# EAGLE design schematic_without_jumperlable (EAGLE 9.6.2)
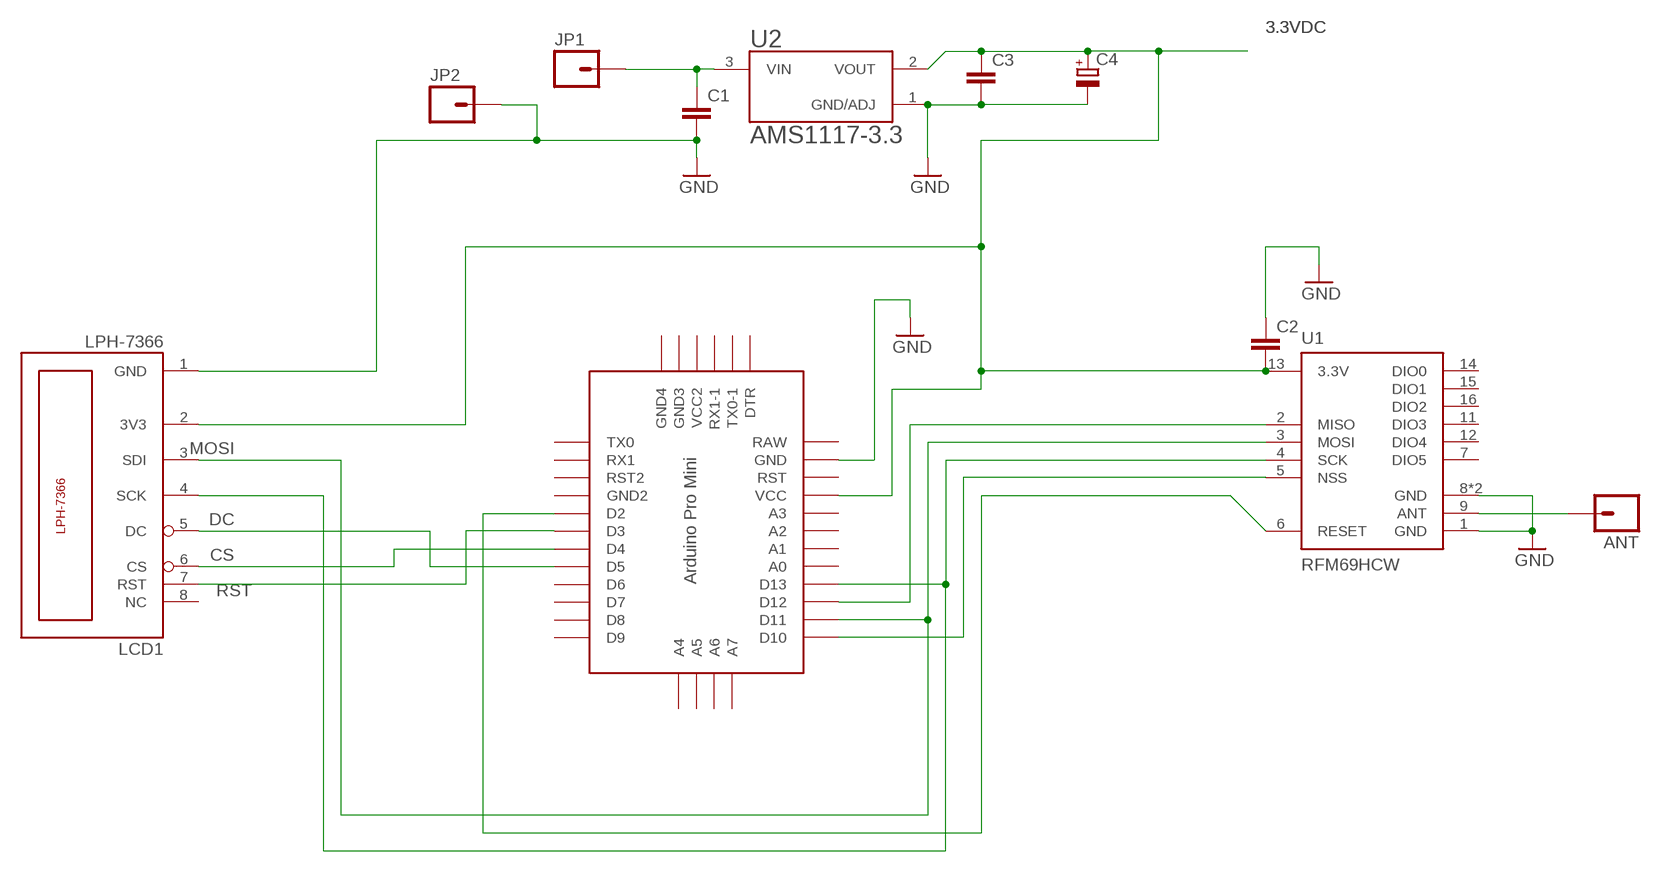
[diagram p0: schematic, sheet 1]

## Parts
ANT  M01SMDNS  [1X01NS]
C1  C-EU025-030X050  [C025-030X050]
C2  C-EU025-030X050  [C025-030X050]
C3  C-EU025-030X050  [C025-030X050]
C4  CPOL-EUE5-8.5  [E5-8,5]
JP1  M01SMDNS  [1X01NS]
JP2  M01SMDNS  [1X01NS]
LCD1  LPH-7366  [LPH-7366]
U1  RFM69HCW  [RFM69HCW-XXXS2]
U2  AMS1117-3.3  [SOT229P700X180-4N]
U$1  PRO-MINI  [PRO-MINI]

## Nets
3.3VDC: C2.2 C3.1 C4.+ LCD1.2(3V3) U1.13(3.3V) U2.2(VOUT) U$1.VCC
ANT: ANT.1 U1.9(ANT)
CS: LCD1.6(CS) U$1.D4
DC: LCD1.5(DC) U$1.D5
GND: C1.2 C2.1 C3.2 C4.- JP2.1 LCD1.1(GND) U1.1(GND) U1.8(GND) U1.10(GND) U2.1(GND/ADJ) U$1.GND
MISO: U1.2(MISO) U$1.D12
MOSI: LCD1.3(SDI) U1.3(MOSI) U$1.D11
NSS: U1.5(NSS) U$1.D10
RESET: U1.6(RESET) U$1.D2
RST: LCD1.7(RST) U$1.D3
SCK: LCD1.4(SCK) U1.4(SCK) U$1.D13
VIN: C1.1 JP1.1 U2.3(VIN)
Unconnected: LCD1.8(NC) U1.7(DIO5) U1.11(DIO3) U1.12(DIO4) U1.14(DIO0) U1.15(DIO1) U1.16(DIO2) U$1.A0 U$1.A1 U$1.A2 U$1.A3 U$1.A4 U$1.A5 U$1.A6 U$1.A7 U$1.D6 U$1.D7 U$1.D8 U$1.D9 U$1.DTR U$1.GND1(GND2) U$1.GND2(GND4) U$1.GND3 U$1.RST U$1.RST1(RST2) U$1.RX1 U$1.RX1-1 U$1.TX0 U$1.TX0-1 U$1.VCC1(VCC2)

## Power pins joined to a net without a drawn wire
RAW: U$1.RAW

## Library data of the parts
ANT JP1 JP2 = mike-temp:M01: Header 1 Standard 1-pin 0.1" header. Use with straight break away headers (SKU : PRT-00116), right angle break away headers (PRT-00553), swiss pins (PRT-00743), machine pins (PRT-00117), and female headers (PRT-00115).
C1-C3 = rcl:C-EU: CAPACITOR, European symbol; SPICEPREFIX: C
C4 = rcl:CPOL-EU: POLARIZED CAPACITOR, European symbol; SPICEPREFIX: C
LCD1 = lph-7366:LPH-7366
U1 = mike-temp:RFM69H
U2 = AMS1117-3.3:AMS1117-3.3: Check availability <https://pricing.snapeda.com/parts/AMS1117-3.3/Advanced%20Monolithic%20Systems/view-part?ref=eda>; AVAILABILITY: In Stock; DESCRIPTION: Sot223/Pkg 1-Amp 3.3-Volt Low Drop Out Voltage Regulatator; MF: Advanced Monolithic Systems; MP: AMS1117-3.3; PACKAGE: SOT-223 Seeed Technology; PRICE: None; PURCHASE-URL: https://pricing.snapeda.com/search/part/AMS1117-3.3/?ref=eda
U$1 = Arduino-clone:PRO-MINI: Arduion Pro Mini Clone V1.0 www.betemcu.cu

## Board
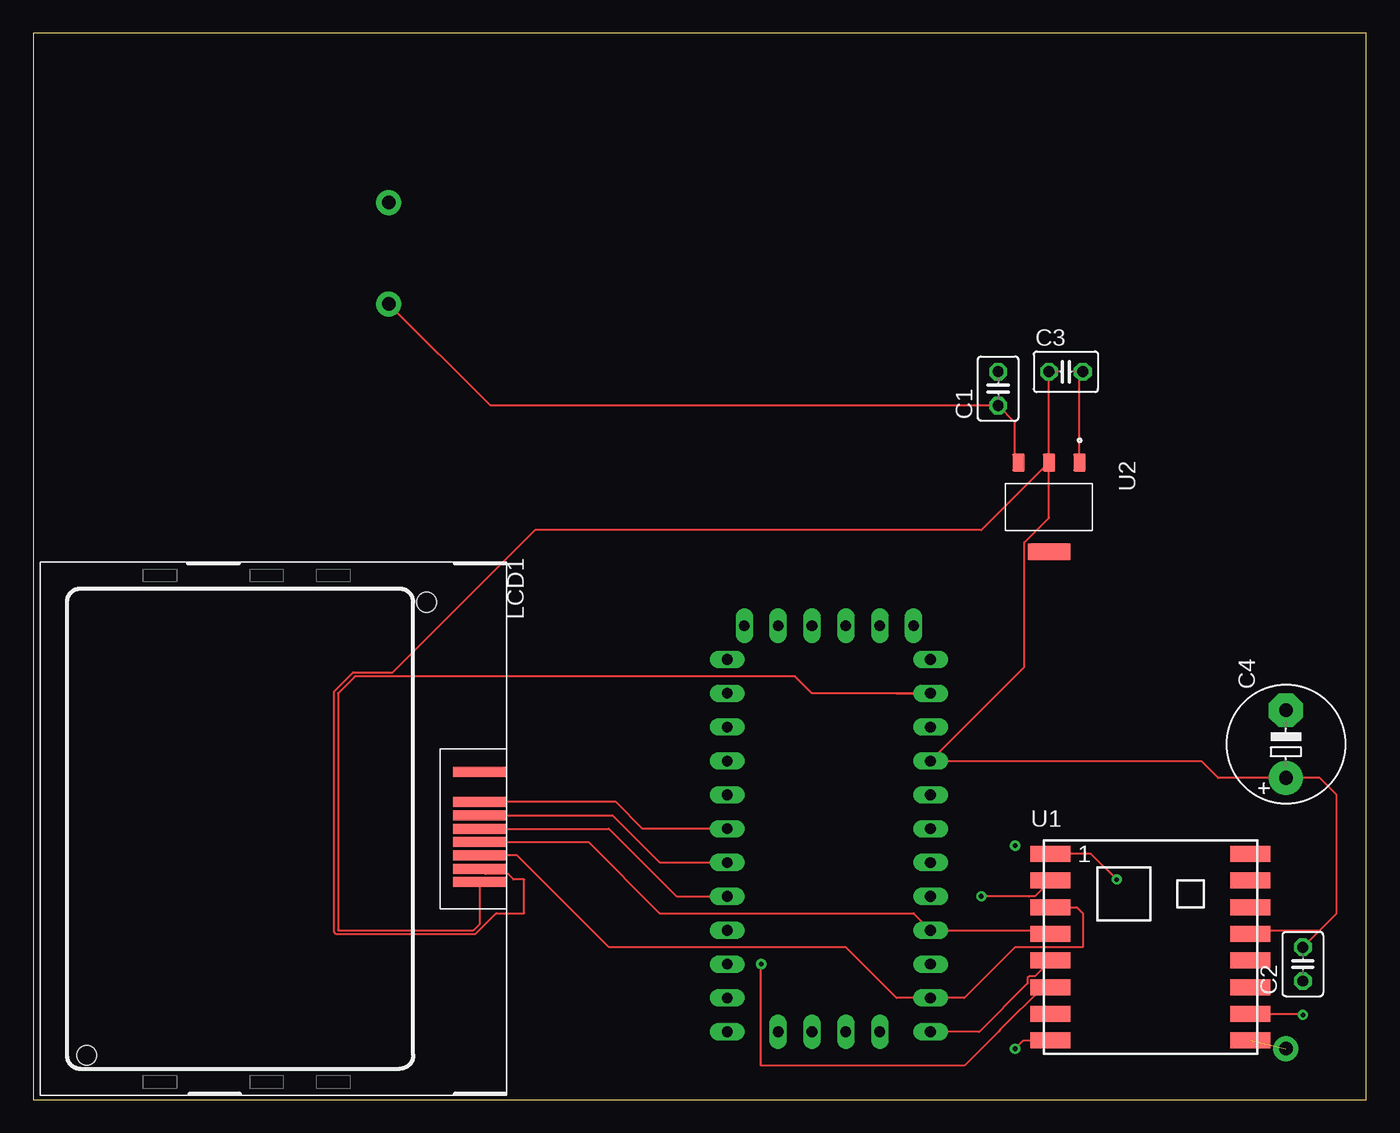
[diagram p1: board, top side]
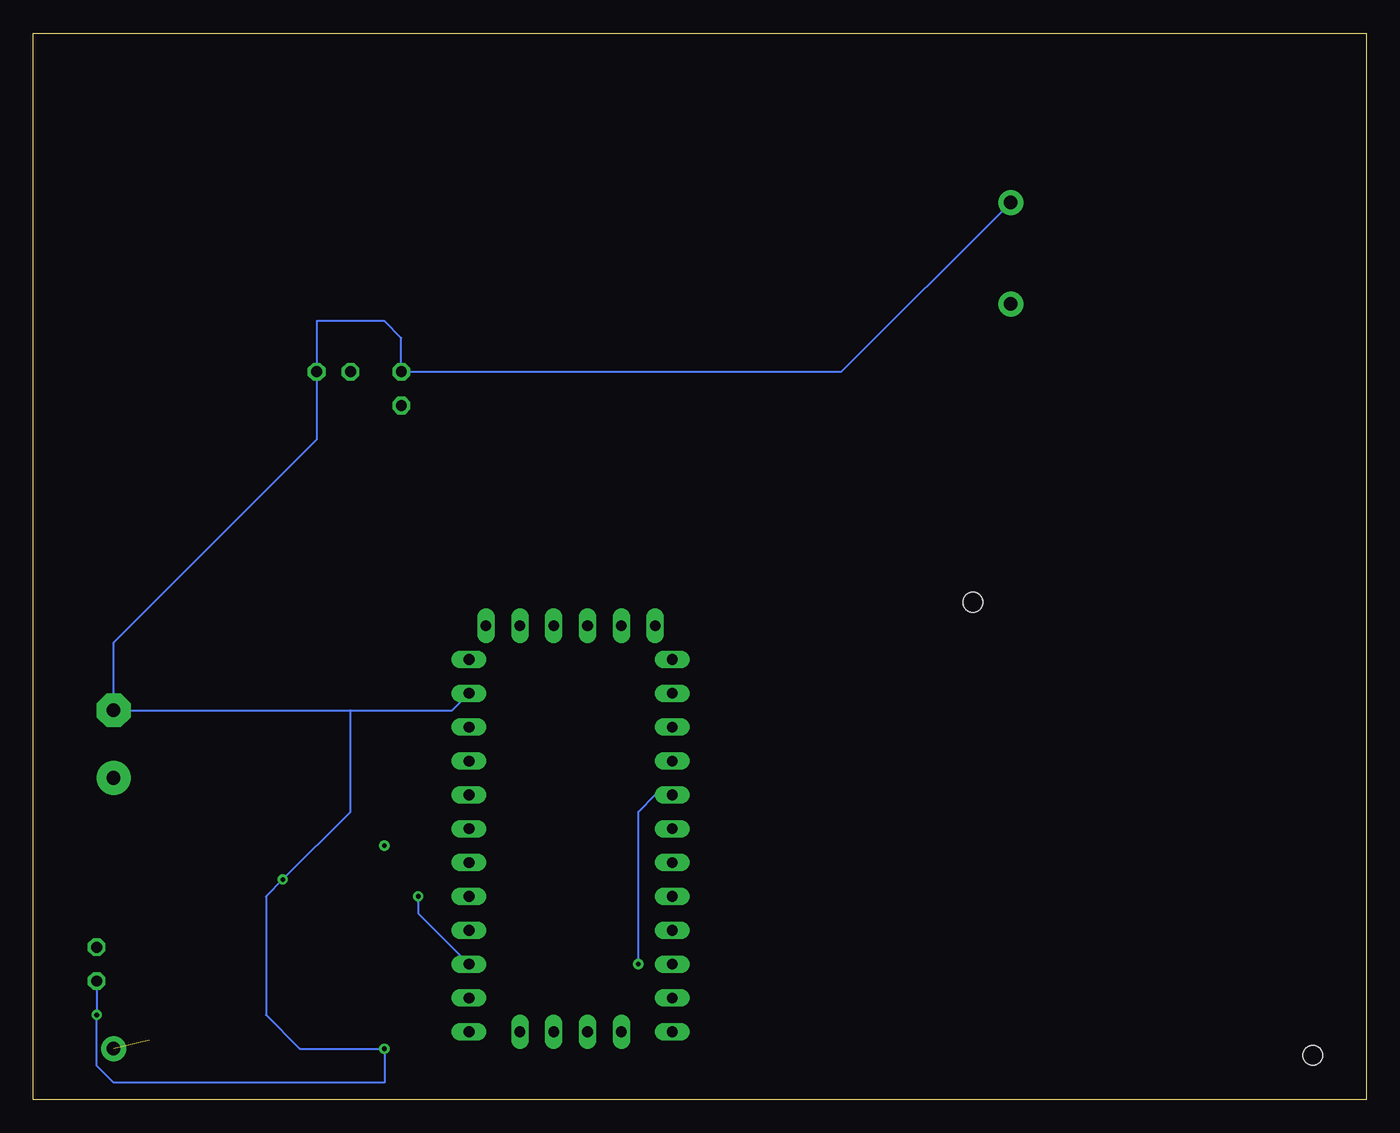
[diagram p2: board, bottom side, seen from below]

Size 100 x 80 mm. Coordinates in mm from the lower left corner, seen from the top.
Outline: 0,0 100,0 100,80 0,80 0,0
Copper layers (1*16): Top 0.035mm / dielectric 1.5mm / Bottom 0.035mm
Design rules "default": minimum track width 6mil, minimum drill 0.35mm, track to track 6mil, track to pad 6mil, pad to pad 6mil, via to via 6mil, smd to smd 6mil, copper to edge 40mil, drill to drill 6mil, minimum pad ring 10mil, minimum via ring 8mil, stop-mask expansion 4mil, vias tented up to drill 0mil, thermal gap 10mil

### Footprints (pad centres in the part's own frame; a part is rotated, then mirrored left to right if it is on the bottom)
1X01NS = drill 1.016 pad 1.88: 1 0,0
C025-030X050 = drill 0.813 octagon: 1 -1.27,0; 2 1.27,0
E5-8,5 = drill 1.016 pad 2.54: + -2.54,0 | drill 1.016 pad 2.54 octagon: - 2.54,0
LPH-7366 = smd 0.75 x 4: 1 4,17; 2 3,17; 3 2,17; 4 1,17; 5 0,17; 6 -1,17; 7 -2,17; 8 -4.27,17 | hole 1.5: -17,13; 17,-12.5
RFM69HCW-XXXS2 = smd 3 x 1.2: 1 -7.5,7; 2 -7.5,5; 3 -7.5,3; 4 -7.5,1; 5 -7.5,-1; 6 -7.5,-3; 7 -7.5,-5; 8 -7.5,-7; 9 7.5,-7; 10 7.5,-5; 11 7.5,-3; 12 7.5,-1; 13 7.5,1; 14 7.5,3; 15 7.5,5; 16 7.5,7
SOT229P700X180-4N = smd 1.31 x 0.93: 1 -3.345,2.29; 2 -3.345,0; 3 -3.345,-2.29 | smd 1.31 x 3.24: 4 3.345,0
PRO-MINI = drill 0.8 long: A0 8.89,8.89; A1 8.89,11.43; A2 8.89,13.97; A3 8.89,16.51; A4 -2.54,-1.27; A5 0,-1.27; A6 2.54,-1.27; A7 5.08,-1.27; D2 -6.35,16.51; D3 -6.35,13.97; D4 -6.35,11.43; D5 -6.35,8.89; D6 -6.35,6.35; D7 -6.35,3.81; D8 -6.35,1.27; D9 -6.35,-1.27; D10 8.89,-1.27; D11 8.89,1.27; D12 8.89,3.81; D13 8.89,6.35; DTR 7.62,29.21; GND 8.89,24.13; GND1 -6.35,19.05; GND2 -5.08,29.21; GND3 -2.54,29.21; RAW 8.89,26.67; RST 8.89,21.59; RST1 -6.35,21.59; RX1 -6.35,24.13; RX1-1 2.54,29.21; TX0 -6.35,26.67; TX0-1 5.08,29.21; VCC 8.89,19.05; VCC1 0,29.21

### Placement (x,y rotation side)
ANT  93.98,3.81 0 top
C1  72.39,53.34 90 top
C2  95.25,10.16 90 top
C3  77.47,54.61 0 top
C4  93.98,26.67 90 top
JP1  26.67,59.69 0 top
JP2  26.67,67.31 0 top
LCD1  16.51,20.32 270 top
U1  83.82,11.43 0 top
U2  76.2,44.45 270 top
U$1  58.42,6.35 0 top

### Tracks (layer width: path | path; a pad name or v marks a point on that pad's centre or on a via)
3.3VDC
  Top 0.152: U1.13 91.59,12.7 96.52,12.7 | 96.52,12.7 97.79,13.97 97.79,22.86 96.52,24.13 C4.+ 88.9,24.13 87.63,25.4 U$1.VCC 74.35,32.44 74.35,41.8 76.2,43.65 U2.2 | U2.2 71.12,42.72 37.63,42.72 26.98,32.05 24,32.05 22.55,30.61 22.55,12.57 22.73,12.39 33.15,12.39 34.72,13.97 36.83,13.97 36.83,16.51 36.02,16.51 35.6,16.92 33.91,16.92 LCD1.2 | C2.2 96.52,12.7 | U2.2 C3.1
ANT  (1 unrouted)
CS
  Top 0.152: LCD1.6 43.45,21.32 46.99,17.78 U$1.D4
DC
  Top 0.152: LCD1.5 43.18,20.32 48.26,15.24 U$1.D5
GND  (via drill 0.35)
  Top 0.152: U1.10 95.17,6.43 v95.25,6.35 | v73.66,3.81 74.28,4.43 U1.8 | v81.28,16.51 79.36,18.43 U1.1 | 64.77,30.48 U$1.GND 58.42,30.48 57.15,31.75 24.13,31.75 22.86,30.48 22.86,12.7 33.02,12.7 33.51,13.19 LCD1.1 | U2.1 78.49,54.36 C3.2
  Bottom 0.152: 76.2,29.21 C4.- 93.98,34.29 78.74,49.53 C3.2 78.74,58.42 73.66,58.42 72.39,57.15 C1.2 39.37,54.61 JP2.1 | 76.2,29.21 68.58,29.21 U$1.GND | C2.1 v95.25,6.35 95.25,2.54 93.98,1.27 73.66,1.27 v73.66,3.81 80.01,3.81 82.55,6.35 82.55,15.24 v81.28,16.51 76.2,21.59 76.2,29.21
MISO  (via drill 0.35)
  Top 0.152: U1.2 75.15,15.26 74.72,15.26 74.71,15.24 v71.12,15.24
  Bottom 0.152: v71.12,15.24 71.12,13.97 U$1.D12
MOSI
  Top 0.152: LCD1.3 36.29,18.32 43.18,11.43 60.96,11.43 64.77,7.62 U$1.D11 69.85,7.62 73.66,11.43 78.74,11.43 78.74,13.97 78.28,14.43 U1.3
N$1  (via drill 0.35)
  other vias: 73.66,19.05
NSS
  Top 0.152: U$1.D10 70.97,5.08 74.59,8.7 74.59,9.12 74.72,9.26 75.15,9.26 U1.5
RESET  (via drill 0.35)
  Top 0.152: v54.61,10.16 54.61,2.54 69.85,2.54 72.39,5.08 72.57,5.26 75.74,8.43 U1.6
  Bottom 0.152: U$1.D2 53.34,22.86 54.61,21.59 v54.61,10.16
RST
  Top 0.152: U$1.D3 45.72,20.32 43.72,22.32 LCD1.7
SCK
  Top 0.152: LCD1.4 41.64,19.32 46.99,13.97 66.04,13.97 U$1.D13 76.05,12.7 U1.4
VIN
  Top 0.152: JP1.1 34.29,52.07 C1.1 73.66,50.8 73.66,48.05 U2.3